# Altium schematic sheet POWER.SchDoc
size A4; SheetNumber: 2; SheetTotal: 3
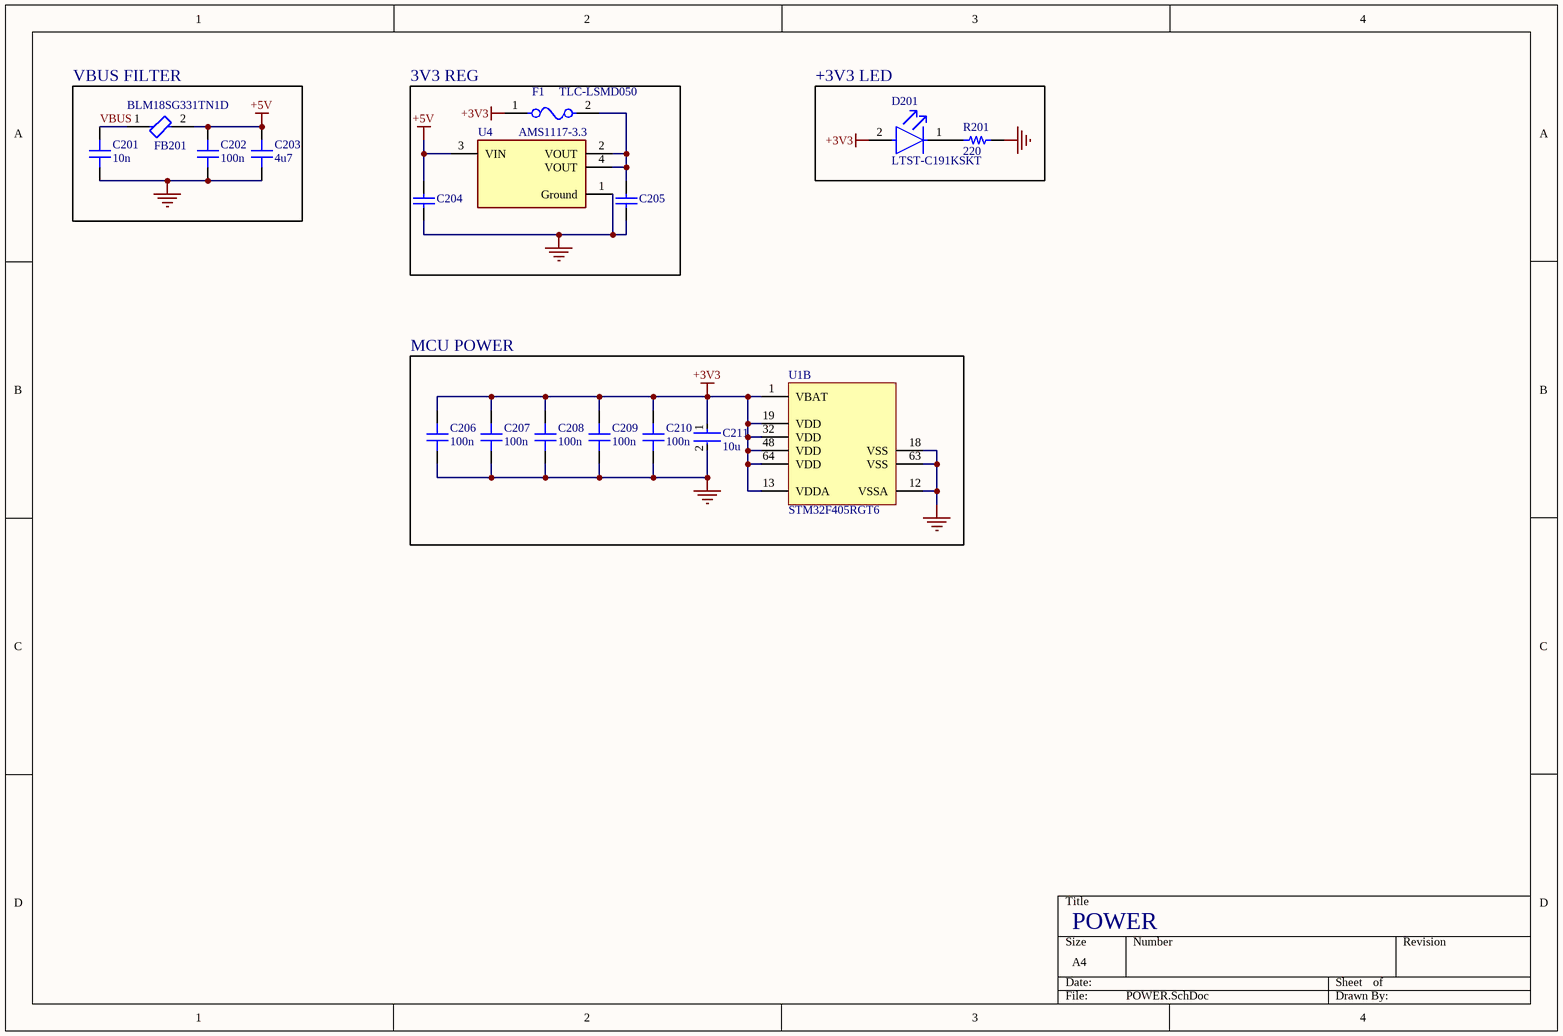
[diagram p0: POWER.SchDoc]

## Parts
C201  10n  [CAP 0603_1608]
C202  100n  [CAP 0603_1608]
C203  4u7  [CAP 0603_1608]
C204  T529P226M010AAE200  [CAPC2013X100X55ML10T10]  (value not drawn)
C205  T529P226M010AAE200  [CAPC2013X100X55ML10T10]  (value not drawn)
C206  100n  [CAP 0402_1005]
C207  100n  [CAP 0402_1005]
C208  100n  [CAP 0402_1005]
C209  100n  [CAP 0402_1005]
C210  100n  [CAP 0402_1005]
C211  10u  [FP-GRM21B-0_2-e0_2_0_7-IPC_B]
D201  LTST-C191KSKT  [FP-LTST-C191KSKT-MFG]
F1  TLC-LSMD050  [FP-2920L-MFG]
FB201  BLM18SG331TN1D  [FP-BLM18-0_15-t0_5-MFG]
R201  220  [RES 0402_1005]
U1  STM32F405RGT6  [STM-LQFP64_M]  (part B of 2)
U4  AMS1117-3.3  [FP-AMS1117-IPC_C]

## Blocks framed on the sheet
VBUS FILTER: C201-C203 FB201
3V3 REG: C204 C205 F1 U4
+3V3 LED: D201 R201
MCU POWER: C206-C211 U1

## Nets
+3V3: C206.2 C207.2 C208.2 C209.2 C210.2 C211.1 D201.2(A) F1.1 U1.1(VBAT) U1.13(VDDA) U1.19(VDD) U1.32(VDD) U1.48(VDD) U1.64(VDD)
+5V: C202.2 C203.2 C204.2 FB201.2 U4.3(VIN)
GND: C201.1 C202.1 C203.1 C204.1 C205.1 C206.1 C207.1 C208.1 C209.1 C210.1 C211.2 R201.2 U1.12(VSSA) U1.18(VSS) U1.63(VSS) U4.1(Ground)
VBUS: C201.2 FB201.1
NetC205_2: C205.2 F1.2 U4.2(VOUT) U4.4(VOUT)
NetD201_1: D201.1(C) R201.1

## Notes on the sheet
- POWER

## Library data of the parts
C201-C203 = CL10A226MPCNUBE: CAP CER 22UF 10V X5R 0603; Part Number: CL10A226MPCNUBE
C204 C205 = CMP-2007-03671-1: Manufacturer: Kemet; Part Number: T529P226M010AAE200
C206-C210 = CL05B104KP5VPNC: CAP CER 100NF 10V X7R 0402; manufacturer: Samsung Electro-Mechanics; Capacitance: 0.1 µF; Tolerance: ±10%; Part Number: CL05B104KP5VPNC; Value: 100n; Applications: Automotive; componentlink1description: Datasheet; componentlink1url: https://mm.digikey.com/Volume0/opasdata/d220001/medias/docus/5458/CL05B104KP5VPNC_Spec.pdf; componentlink2description: DigiKey Link; componentlink2url: https://www.digikey.com/en/products/detail/samsung-electro-mechanics/CL05B104KP5VPNC/20498482; Device Package: 0402 (1005 Metric); lastupdated: 29/01/2024 8:03:07 PM; Lifecycle Status: Active; Minimum Order: 1; Mounting Type: Surface Mount, MLCC; Operating Temperature: -55°C ~ 125°C; Package / Case: 0402 (1005 Metric); packaging: TapeAndReel; partid: 56690; price: 0.01; Ratings: AEC-Q200; series: CL; Size / Dimension: 0.039" L x 0.020" W (1.00mm x 0.50mm); Supplier 1: DigiKey; Supplier Part Number 1: 1276-CL05B104KP5VPNCCT-ND; Temperature Coefficient: X7R; Thickness (Max): 0.022" (0.55mm); Voltage - Rated: 10V
C211 = CMP-06035-047417-1: Chip Multilayer Ceramic Capacitors for General Purpose, 0805, 10uF, X7R, 15%, 10%, 25V
D201 = CMP-22017-000025-1: LED YELLOW CLEAR SMD; Dominant Wavelength: 597nm; Power Rating: 75mW; Number of LEDs: 1; Lens Style: Diffused; Forward Current: 30mA; Test Current: 20mA; Forward Voltage: 2.4V; Wavelength: 588nm; Viewing Angle: 130°; Lens Color: Colorless; Reverse Voltage: 5V; Luminous Intensity: 180mcd; Case Code (Imperial): 0603; Width: 0.8mm; Power Dissipation: 75mW; Length: 1.6mm; Illumination Color: Yellow; Number of Pins: 2; Case Code (Metric): 1608; Mount: Surface Mount; Number of Elements: 1; Height: 0.55mm; Lens Transparency: Clear; Depth: 0.8mm; Min Operating Temperature: -55°C; Case/Package: 0603; Radiation Hardening: No; Max Operating Temperature: 85°C; Package Quantity: 1; Packaging: Tape and Reel; Lead Free: Lead Free; Color: Yellow
F1 = CMP-2000-05550-2: PTC RESET FUSE 15V 3A 2920; Manufacturer: Littelfuse; Manufacturer Part Number: 2920L300/15DR; Current Rating: 40A; Trip Current: 5A; Trip Time: 20s; Resistance: 0.015-0.048Ω; Value: 0.015-0.048Ω; Device Class L3: unset; Temperature: -40°C to +85°C; ComponentLink2Description: Datasheet; Temperature Range High: +85°C; Digikey Description: PTC RESET FUSE 15V 3A 2920; Lead Free: Yes; Height: 1.25mm; Voltage Rating: 15V; Package: 2920L; Temperature Range Low: -40°C; Ambient Temperature Range High: +85°C; RoHS: TRUE; Ambient Temperature Range Low: -40°C; Device Class L2: PTC Resettable Fuses; Category: Fuse; Automotive: No; ComponentLink2URL: https://m.littelfuse.com/~/media/electronics/datasheets/resettable_ptcs/littelfuse_ptc_2920l_datasheet.pdf.pdf; Device Class L1: Circuit Protection; Hold Current: 3A; Octopart: https://octopart.com/2920l300%2F15dr-littelfuse-673797
FB201 = CMP-0686-00608-3: Chip Ferrite Bead, 0603, 330Ω @ 100MHz, 25%, 0.07Ω, 1.5A; Impedance: 330R; Number of Lines: 1; DC Resistance-Max: 70mR; RoHS Compliant: Yes; Series: BLM18S; Max Current Rating: 1.5A; Width: 0.8mm; Case Code (Metric): 1608; Min Operating Temperature: -55°C; Number of Pins: 2; Lead Free: Lead Free; Material: Ferrite; DC Resistance (DCR): 70mR; Frequency: 100MHz; Tolerance: 25%; REACH SVHC: No SVHC; Current Rating: 1.5A; Depth: 0.8mm; Length: 1.6mm; Packaging: Tape and Reel; Case/Package: 0603; Termination: SMD/SMT; Number of Circuits: 1; Max Operating Temperature: 125°C; Case Code (Imperial): 0603; Height: 0.8mm; Package Quantity: 1; Max DC Current: 1.5A; Core Material: Ferrite; Test Frequency: 100MHz
R201 = RP73PF1E10KBTD: RES 10K OHM 0.1% 1/10W 0402; Part Number: RP73PF1E10KBTD
U1 = CMP-0243-00019-3: ARM Cortex-M4 32-bit MCU+FPU, 210 DMIPS, 1024 kB Flash, 192 kB Internal RAM, 51 I/Os, 64-pin LQFP, -40 to 85 degC, Tray; Manufacturer: STMicroelectronics; Supply Voltage(Vcc) min (V): 1.8; Supply Voltage(Vcc) max (V): 3.6; Internal RAM Size (kB): 192; I/Os (High Current): 51; D/A Converter: 2x12-bit; FLASH Size (Prog) (kB): 1024; Operating Frequency(F) (Processor speed) (MHz): 168; ComponentLink2Description: Datasheet; PackageVersion: Rev. 4, 06/2013; DatasheetVersion: Rev. 4; Core: ARM Cortex-M4; ComponentLink2URL: http://www.st.com/st-web-ui/static/active/en/resource/technical/document/datasheet/DM00037051.pdf; PackageReference: LQFP64; Packing: Tray; ComponentLink1Description: Manufacturer URL; ComponentLink3URL: http://www.st.com/st-web-ui/static/active/en/resource/technical/document/datasheet/DM00037051.pdf; ComponentLink3Description: Package Specification; Mounting Technology: Surface Mount; ComponentLink1URL: http://www.st.com/web/en/home.html; PackageDescription: 64-Pin Low Profile Quad Flat Package, 10 x 10 mm Body, 0.5 mm Pitch; PartNumber: STM32F405RGT6
U4 = CMP-209535-000001-1: LDO Voltage Regulators 1A, 3.3V; Manufacturer: Advanced Monolithic Systems; Dropout Voltage: 1.1V; Output Type: Fixed; Nominal Supply Current: 5mA; Max Power Dissipation: 1.2W; Max Supply Voltage: 15V; Number Of Outputs: 1; Standoff Height: 0.64mm; Max Junction Temp: +125°C; Height: 1.8mm; Package: AMS1117; Device Class L2: Power Management ICs; ComponentLink2Description: Datasheet; ComponentLink2URL: http://www.advanced-monolithic.com/pdf/ds1117.pdf; Category: IC; RoHS: TRUE; Automotive: No; Device Class L1: Integrated Circuits (ICs); Output Current: 1A; Device Class L3: Voltage Regulators - Linear; Temperature: -40°C to +125°C; Output Voltage: 3.3V; Manufacturer Part Number: AMS1117-3.3; Temperature Range Low: -40°C; Octopart: https://octopart.com/ams1117-3.3-advanced+monolithic+systems-25899300; Lead Free: Yes; Ipc Land Pattern Name: SOT229P700X180-4; Temperature Range High: +125°C